# EAGLE design ECG 7 by 7 (EAGLE 9.6.2)
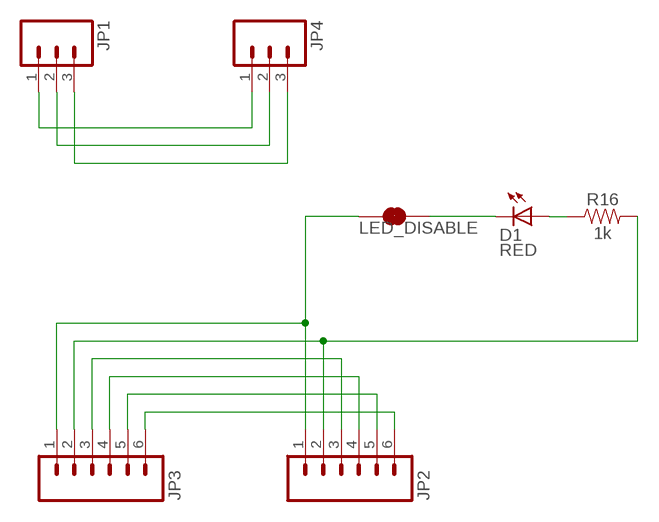
[diagram p0: schematic, sheet 1]

## Parts
D1  RED  LED-RED0603  [LED-0603]
JP1  M03PTH  [1X03]
JP2  M06SIP  [1X06]
JP3  M06SIP  [1X06]
JP4  M03PTH  [1X03]
LED_DISABLE  JUMPER-SMT_2_NC_TRACE_SILK  [SMT-JUMPER_2_NC_TRACE_SILK]
R16  1k  1KOHM-0603-1/10W-1%  [0603]

## Nets
N$1: JP1.1 JP4.1
N$2: JP1.2 JP4.2
N$3: JP1.3 JP4.3
N$4: JP2.6 JP3.6
N$5: JP2.5 JP3.5
N$6: JP2.4 JP3.4
N$7: JP2.3 JP3.3
N$8: JP2.2 JP3.2 R16.2
N$9: JP2.1 JP3.1 LED_DISABLE.1
N$26: D1.A R16.1
N$28: D1.C LED_DISABLE.2

## Library data of the parts
D1 = SparkFun-LED:LED-RED: Assorted Red LEDs LilyPad 1206- DIO-09912 1206- DIO-00809 0603- DIO-00819; PROD_ID: DIO-00819
JP1 JP4 = SparkFun-Connectors:M03: Header 3 Standard 3-pin 0.1" header. Use with straight break away headers (SKU : PRT-00116), right angle break away headers (PRT-00553), swiss pins (PRT-00743), machine pins (PRT-00117), and female headers (PRT-00115). Molex polarized connector foot print use with SKU : PRT-08232 with associated crimp pins and housings.
JP2 JP3 = SparkFun-Connectors:M06: Header 6 Standard 6-pin 0.1" header. Use with straight break away headers (SKU : PRT-00116), right angle break away headers (PRT-00553), swiss pins (PRT-00743), machine pins (PRT-00117), and female headers (PRT-00115). Molex polarized connector foot print use with SKU : PRT-08094 with associated crimp pins and housings. NOTES ON THE VARIANTS LOCK and LOCK_LONGPADS... This footprint was designed to help hold the alignment of a through-hole component (i.e. 6-pin header) while soldering it into place. You may notice that each hole has been shifted either up or down by 0.005 of an inch from it's more standard position (which is a perfectly straight line). This slight alteration caused the pins (the squares in the middle) to touch the edges of the holes. Because they are alternating, it causes a "brace" to hold the component in place. 0.005 has proven to be the perfect amount of "off-center" position when using our standard breakaway headers. Although looks a little odd when you look at the bare footprint, once you have a header in there, the alteration is very hard to notice. Also,if you push a header all the way into place, it is covered up entirely on the bottom side. This idea of altering the position of holes to aid alignment will be further integrated into the Sparkfun Library for other footprints. It can help hold any component with 3 or more connection pins.
LED_DISABLE = SparkFun-Jumpers:JUMPER-SMT_2_NC_TRACE: Normally closed trace jumper This jumper has a trace between two pads so it's normally closed (NC). Use a razor knife to open the connection. For best results follow the IPC guidelines for cutting traces: Cutout at least 0.063 mm (0.005 in). Remove all loose material to clean up the cut area. Seal the cut with an approved epoxy. Reapply solder to reclose the connection.
R16 = SparkFun-Resistors:1KOHM: 1kΩ resistor A resistor is a passive two-terminal electrical component that implements electrical resistance as a circuit element. Resistors act to reduce current flow, and, at the same time, act to lower voltage levels within circuits. - Wikipedia; PROD_ID: RES-07856

## Board
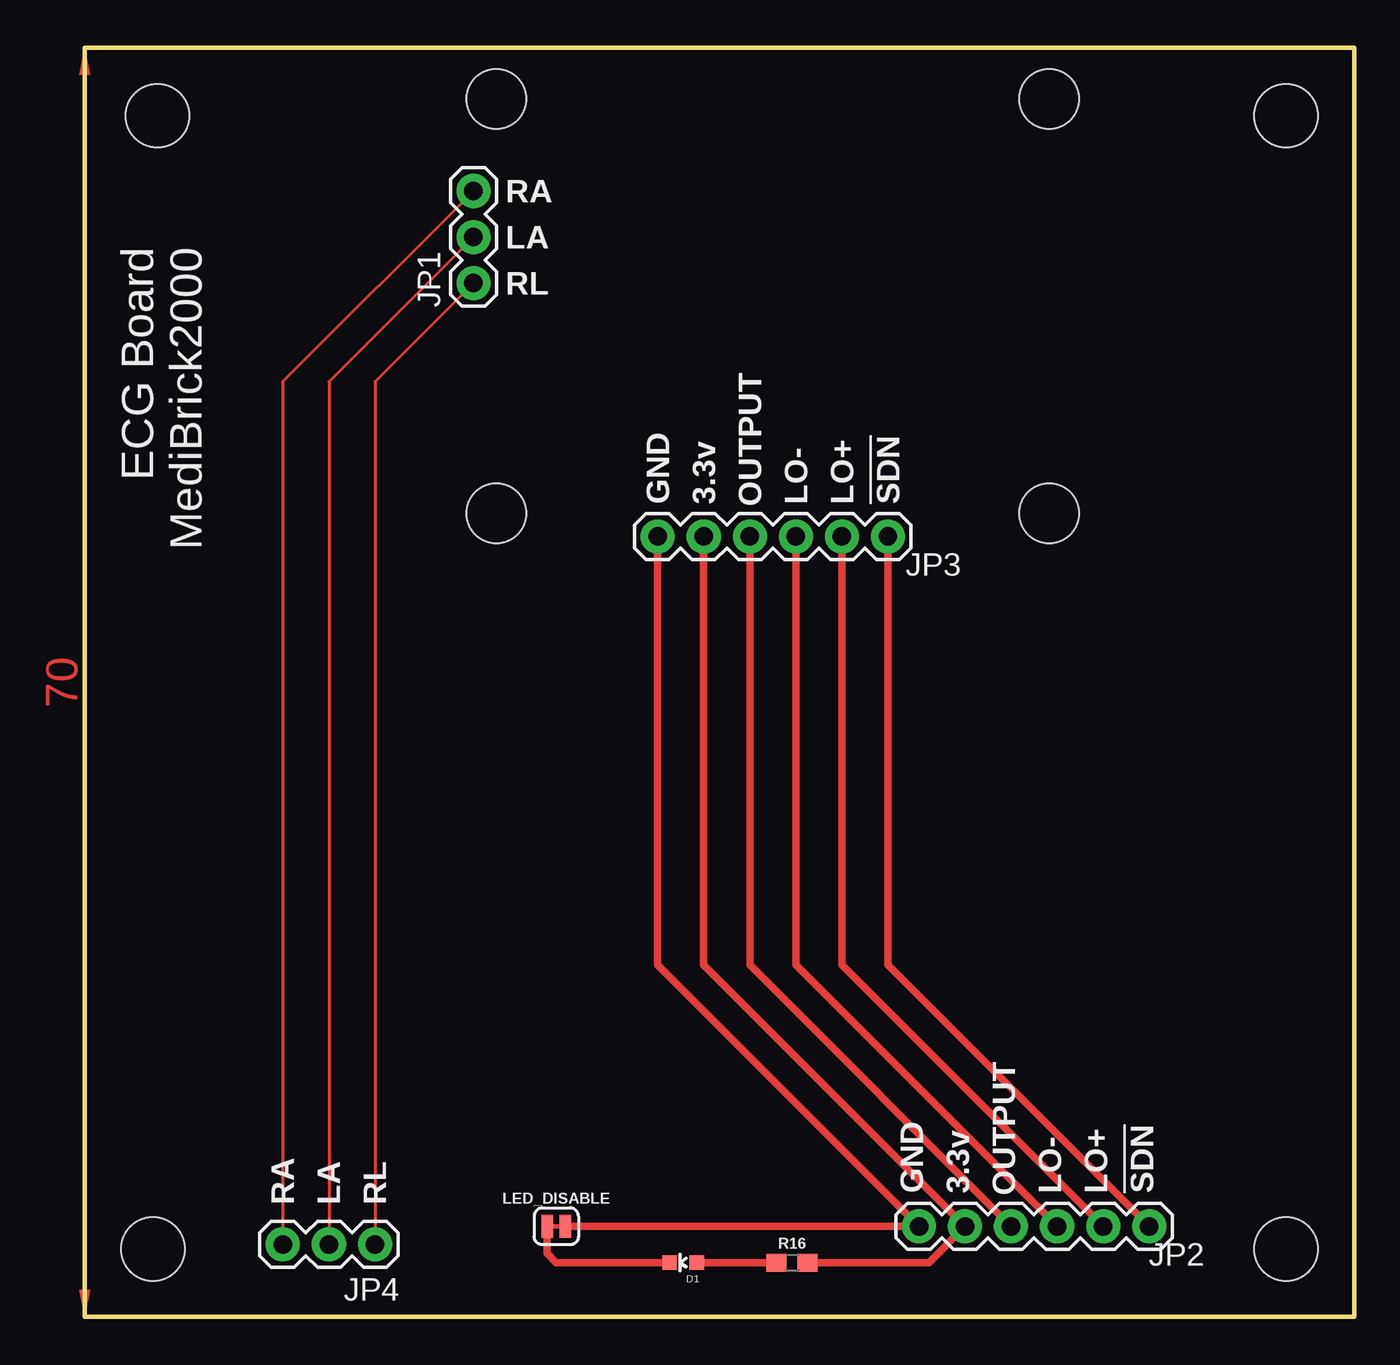
[diagram p1: board, top side]
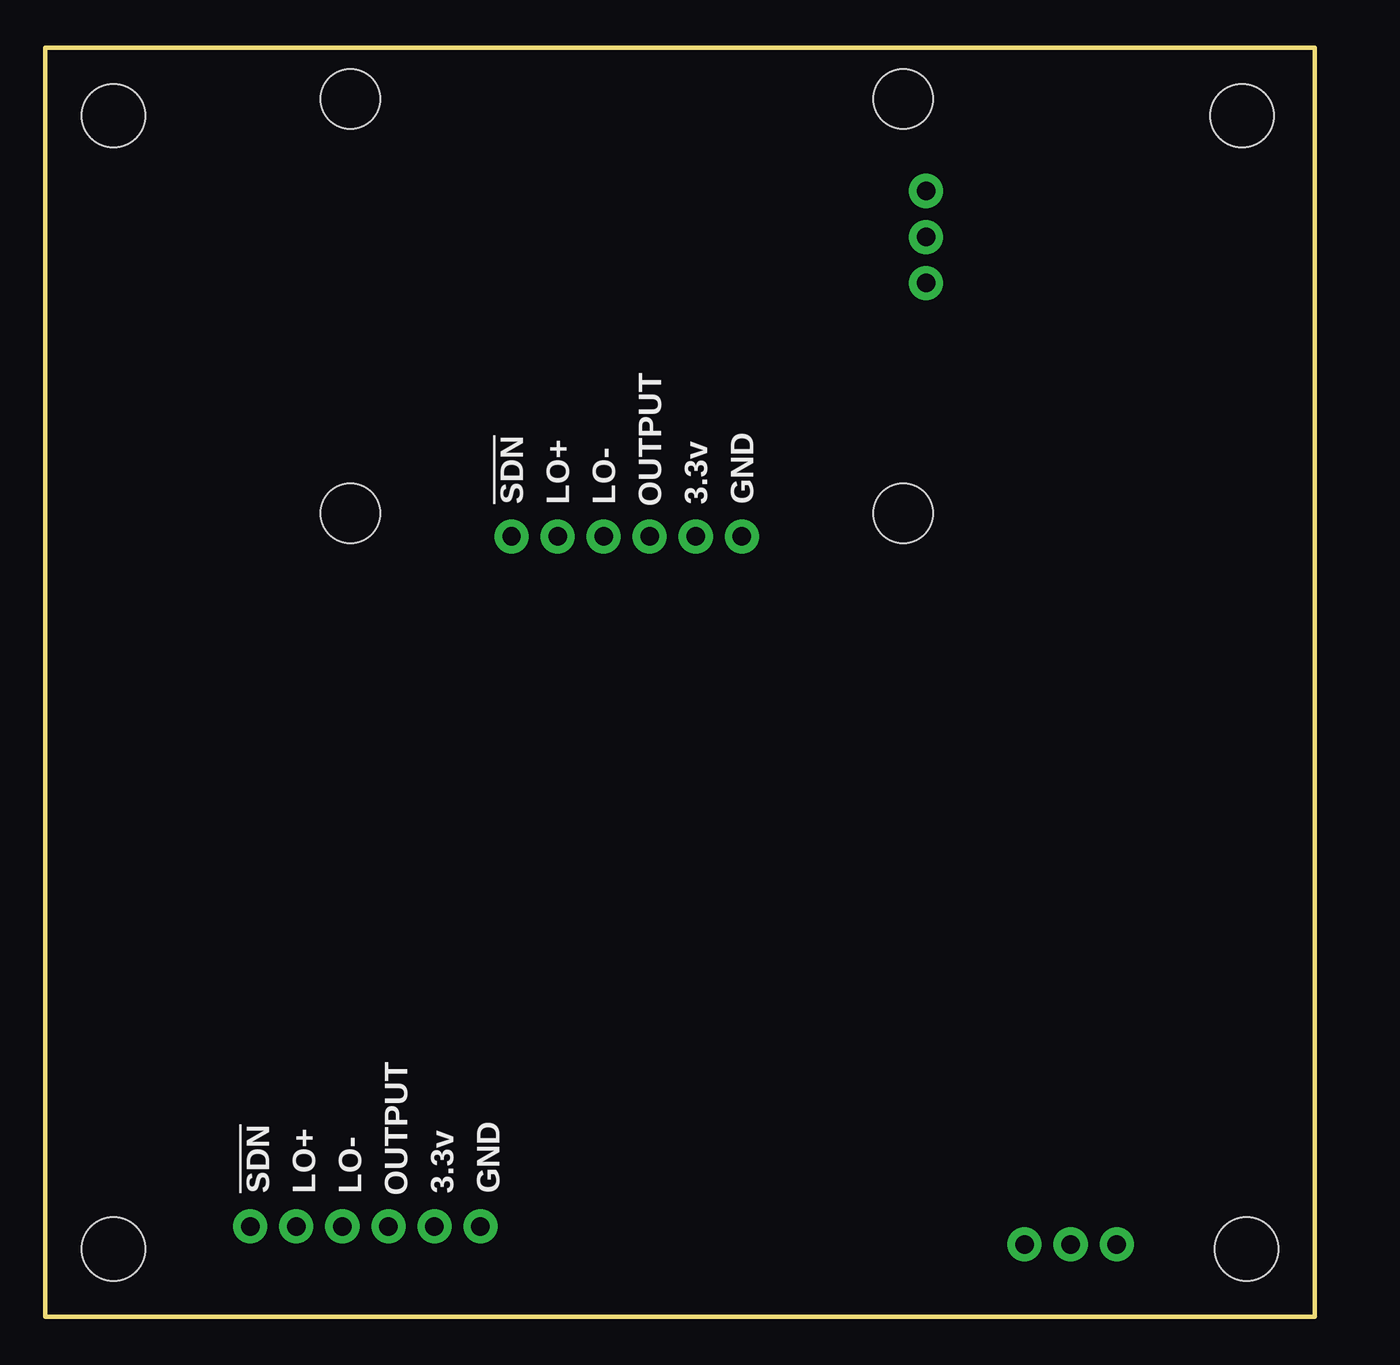
[diagram p2: board, bottom side, seen from below]

Size 70 x 70 mm. Coordinates in mm from the lower left corner, seen from the top.
Outline: 70,0 70,70 0,70 0,0 70,0
Copper layers (1*16): Top 0.035mm / dielectric 1.5mm / Bottom 0.035mm
Design rules "default": minimum track width 7mil, minimum drill 15mil, track to track 6mil, track to pad 8mil, pad to pad 8mil, via to via 8mil, smd to smd 8mil, copper to edge 8mil, drill to drill 8mil, minimum pad ring 12mil, minimum via ring 10mil, stop-mask expansion 4mil, vias tented up to drill 20mil, thermal gap 10mil
Holes 3.5 mm at 4,66.25 66.25,66.25 3.75,3.75 66.25,3.75

### Footprints (pad centres in the part's own frame; a part is rotated, then mirrored left to right if it is on the bottom)
LED-0603 = smd 0.8 x 0.8: A 0,-0.75; C 0,0.75
1X03 = drill 1.016 pad 1.88: 1 0,0; 2 2.54,0; 3 5.08,0
1X06 = drill 1.016 pad 1.88: 1 0,0; 2 2.54,0; 3 5.08,0; 4 7.62,0; 5 10.16,0; 6 12.7,0
SMT-JUMPER_2_NC_TRACE_SILK = smd 0.635 x 1.27: 1 -0.508,0; 2 0.508,0
0603 = smd 1.1 x 1: 1 -0.85,0; 2 0.85,0
STAND-OFF = hole 3.302: 0,0

### Placement (x,y rotation side)
D1  33,3 90 top
JP1  21.43,57.02 90 top
JP2  46,5 0 top
JP3  31.59,43.05 0 top
JP4  16,4 180 top
LED_DISABLE  26,5 180 top
R16  39,3 0 top
STANDOFF1  STAND-OFF  [STAND-OFF]  22.7,67.18 0 top
STANDOFF2  STAND-OFF  [STAND-OFF]  53.18,67.18 0 top
STANDOFF3  STAND-OFF  [STAND-OFF]  53.18,44.32 0 top
STANDOFF4  STAND-OFF  [STAND-OFF]  22.7,44.32 180 top

### Tracks (layer width: path | path; a pad name or v marks a point on that pad's centre or on a via)
N$1
  Top 0.178: JP1.1 16,51.59 JP4.1
N$2
  Top 0.178: JP1.2 13.46,51.59 JP4.2
N$3
  Top 0.178: JP1.3 10.92,51.59 JP4.3
N$4
  Top 0.406: JP3.6 44.29,19.41 JP2.6
N$5
  Top 0.406: JP3.5 41.75,19.41 JP2.5
N$6
  Top 0.406: JP3.4 39.21,19.41 JP2.4
N$7
  Top 0.406: JP3.3 36.67,19.41 JP2.3
N$8
  Top 0.406: JP3.2 34.13,19.41 JP2.2 46.54,3 R16.2
N$9
  Top 0.406: JP3.1 31.59,19.41 JP2.1 LED_DISABLE.1
N$26
  Top 0.406: D1.A R16.1
N$28
  Top 0.406: LED_DISABLE.2 25.49,3.51 26,3 D1.C
(copper drawn outside any net)
  shapes: Top area x1

### Text on the board
tPlace: RA | LA | RL | GND | 3.3v | OUTPUT | LO- | LO+ | !SDN | GND | 3.3v | OUTPUT | LO- | LO+ | !SDN | RA | LA | RL
bPlace: GND | 3.3v | OUTPUT | LO- | LO+ | !SDN | GND | 3.3v | OUTPUT | LO- | LO+ | !SDN
tNames: ECG Board / MediBrick2000